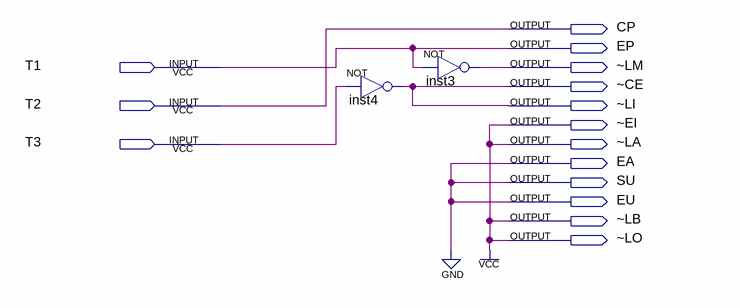
[diagram p0: schematic sheet]
// Quartus schematic Fetch.bdf as structural Verilog: 2 symbols, 15 pins
module Fetch (
  input  T1,
  input  T2,
  input  T3,
  output CP,
  output EP,
  output \~LM ,
  output \~CE ,
  output \~LI ,
  output \~EI ,
  output \~LA ,
  output EA,
  output SU,
  output EU,
  output \~LB ,
  output \~LO 
);

  not inst4 (\~CE , T3);
  not inst3 (\~LM , T1);

  assign CP = T2;
  assign EA = 1'b0;
  assign EP = T1;
  assign EU = 1'b0;
  assign SU = 1'b0;
  assign \~EI  = 1'b1;
  assign \~LA  = 1'b1;
  assign \~LB  = 1'b1;
  assign \~LI  = \~CE ;
  assign \~LO  = 1'b1;
endmodule
